# EAGLE schematic ATtinyProgrammer (EAGLE 7.3.0)
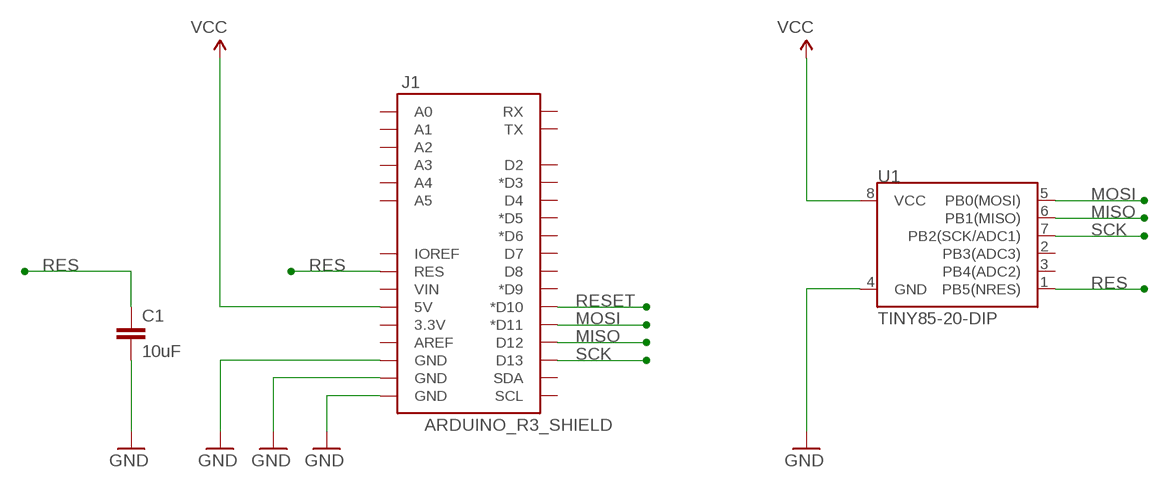
[diagram p0: schematic, sheet 1]

## Parts
C1  10uF  0.1UF-50V-20%(PTH)KIT-EZ  [CAP-PTH-SMALL-KIT]
J1  ARDUINO_R3_SHIELD  [UNO_R3_SHIELD]
U1  TINY85-20-DIP  ATTINY45TINY85-20-DIP  [DIP08]

## Nets
GND: C1.2 J1.GND@0(GND) J1.GND@1(GND) J1.GND@2(GND) U1.4(GND)
MISO: J1.D12 U1.6(PB1(MISO))
MOSI: J1.D11(*D11) U1.5(PB0(MOSI))
RES: C1.1 J1.RES U1.1(PB5(NRES))
RESET: J1.D10(*D10)
SCK: J1.D13 U1.7(PB2(SCK/ADC1))
VCC: J1.5V U1.8(VCC)
Unconnected: J1.3.3V J1.A0 J1.A1 J1.A2 J1.A3 J1.A4 J1.A5 J1.AREF J1.D2 J1.D3(*D3) J1.D4 J1.D5(*D5) J1.D6(*D6) J1.D7 J1.D8 J1.D9(*D9) J1.IOREF J1.RX J1.SCL J1.SDA J1.TX J1.VIN U1.2(PB3(ADC3)) U1.3(PB4(ADC2))

## Library data of the parts
C1 = SparkFun-Capacitors:0.1UF-50V-20%(PTH): CAP-08370; PROD_ID: CAP-08370
J1 = SparkFun-Boards:ARDUINO_R3_SHIELD: Shield form compatible with the Arduino Uno R3.
U1 = SparkFun-DigitalIC:ATTINY45: Atmel 8-pin 2/4/8kB flash uC; PROD_ID: IC-09445